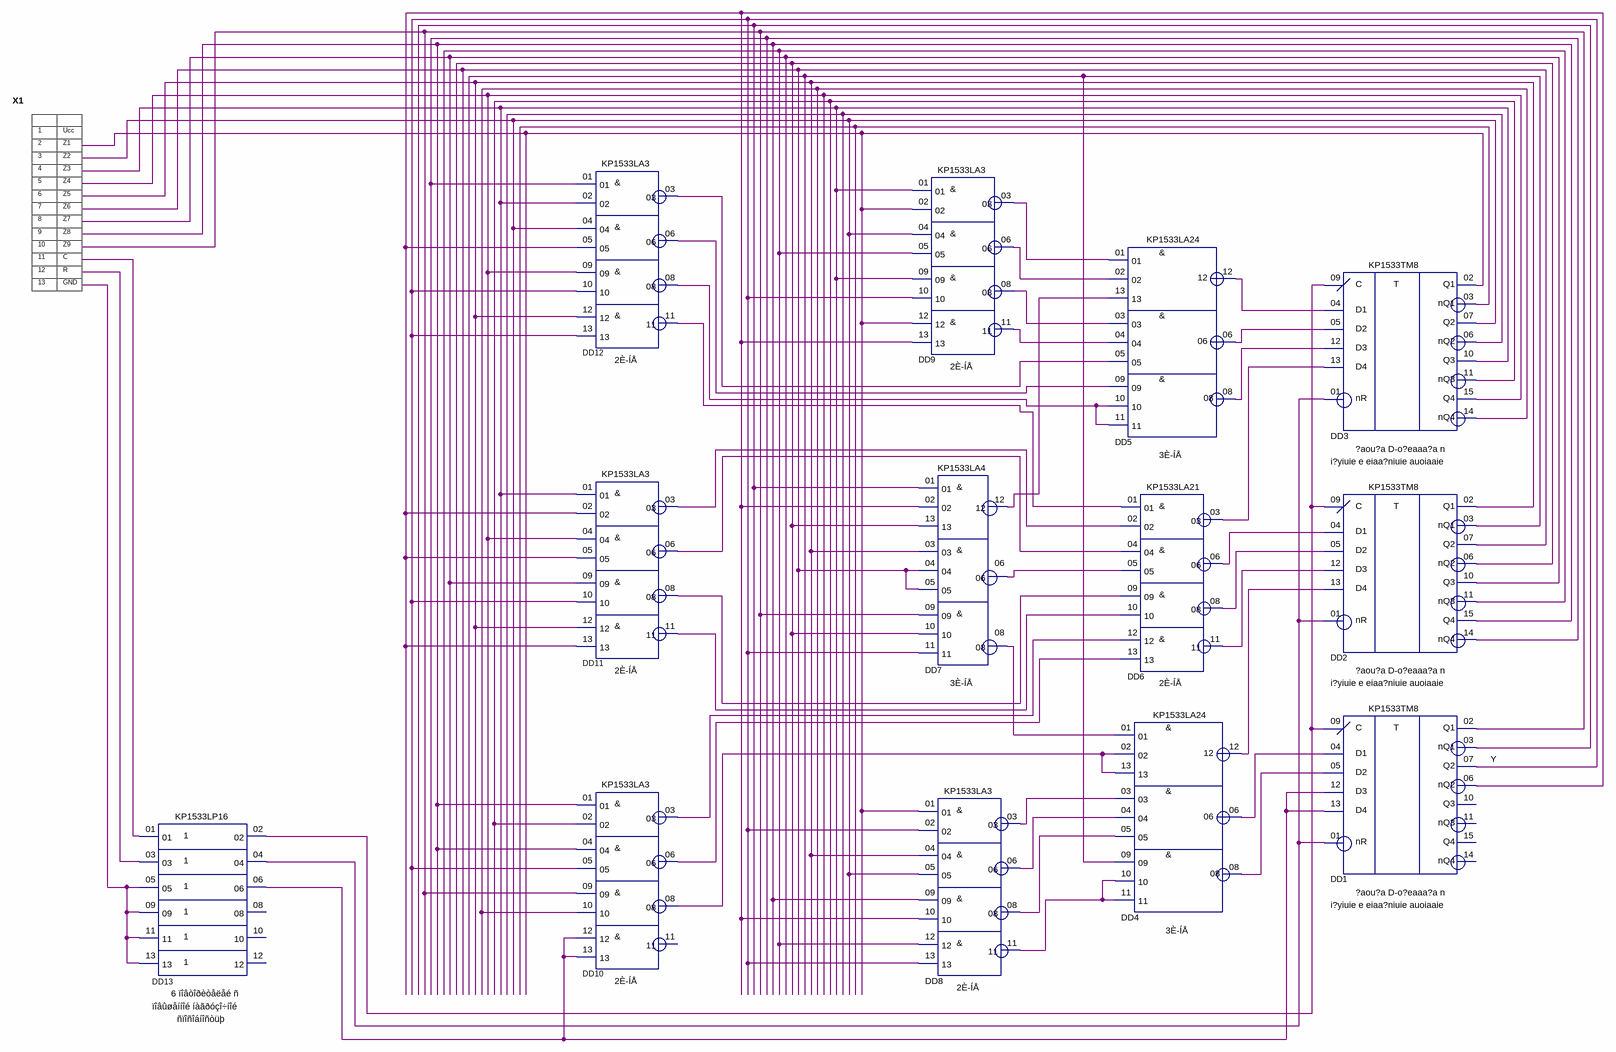
[diagram p0: schematic sheet]
// Quartus schematic _SR.bdf as structural Verilog: 13 symbols, 0 pins
module _SR (
);

  wire DD1_nq1, DD1_nq2, DD1_q1, DD2_nq1, DD2_nq2, DD2_nq3, DD2_nq4, DD2_q1, DD2_q2, DD2_q3, DD2_q4, DD3_nq1,
       DD3_nq2, DD3_nq3, DD3_nq4, DD3_q1, DD3_q2, DD3_q3, DD3_q4, DD4_06, DD4_08, DD4_12, DD5_06, DD5_08,
       DD5_12, DD6_03, DD6_06, DD6_08, DD6_11, DD7_06, DD7_08, DD7_12, DD8_03, DD8_06, DD8_08, DD8_11,
       DD9_03, DD9_06, DD9_08, DD9_11, DD10_03, DD10_06, DD10_08, DD11_03, DD11_06, DD11_08, DD11_11,
       DD12_03, DD12_06, DD12_08, DD12_11, DD13_02, DD13_04, DD13_06, undriven, undriven_2, undriven_3, Y;

  KP1533LP16 DD13 (
    .\01 (undriven_2), .\03 (undriven_3), .\05 (undriven), .\09 (undriven), .\11 (undriven), .\13 (undriven),
    .\02 (DD13_02), .\04 (DD13_04), .\06 (DD13_06));  // open: 08, 10, 12
  KP1533LA3 DD12 (
    .\01 (DD2_nq4), .\02 (DD3_q3), .\04 (DD3_q2), .\05 (DD1_nq2), .\09 (DD3_q4), .\10 (Y), .\12 (DD2_q1),
    .\13 (Y), .\03 (DD12_03), .\06 (DD12_06), .\08 (DD12_08), .\11 (DD12_11));
  KP1533LA3 DD11 (
    .\01 (DD3_q3), .\02 (DD1_nq2), .\04 (DD3_q4), .\05 (DD1_nq2), .\09 (DD2_q3), .\10 (Y), .\12 (DD2_q1),
    .\13 (DD1_nq2), .\03 (DD11_03), .\06 (DD11_06), .\08 (DD11_08), .\11 (DD11_11));
  KP1533LA3 DD10 (
    .\01 (DD2_q4), .\02 (DD3_nq3), .\04 (DD2_q4), .\05 (Y), .\09 (DD1_q1), .\10 (DD3_nq4), .\12 (DD13_06),
    .\13 (DD13_06), .\03 (DD10_03), .\06 (DD10_06), .\08 (DD10_08));  // open: 11
  KP1533LA3 DD9 (
    .\01 (DD3_q3), .\02 (DD3_q1), .\04 (DD3_q2), .\05 (DD2_nq3), .\09 (DD3_q3), .\10 (Y), .\12 (DD3_q1),
    .\13 (DD1_nq2), .\03 (DD9_03), .\06 (DD9_06), .\08 (DD9_08), .\11 (DD9_11));
  KP1533LA4 DD7 (
    .\01 (DD1_nq1), .\02 (DD1_nq2), .\13 (DD2_nq2), .\03 (DD2_q1), .\04 (DD2_q2), .\05 (DD2_q2),
    .\09 (DD1_q1), .\10 (DD2_nq2), .\11 (Y), .\12 (DD7_12), .\06 (DD7_06), .\08 (DD7_08));
  KP1533LA3 DD8 (
    .\01 (DD3_q1), .\02 (Y), .\04 (DD2_q1), .\05 (DD3_q2), .\09 (DD2_q4), .\10 (DD1_nq2), .\12 (DD2_nq3),
    .\13 (Y), .\03 (DD8_03), .\06 (DD8_06), .\08 (DD8_08), .\11 (DD8_11));
  KP1533LA24 DD5 (
    .\01 (DD9_03), .\02 (DD9_06), .\13 (DD7_12), .\03 (DD9_08), .\04 (DD9_11), .\05 (DD12_03),
    .\09 (DD12_06), .\10 (DD12_08), .\11 (DD12_08), .\12 (DD5_12), .\06 (DD5_06), .\08 (DD5_08));
  KP1533LA21 DD6 (
    .\01 (DD12_11), .\02 (DD11_03), .\04 (DD11_06), .\05 (DD7_06), .\09 (DD11_08), .\10 (DD11_11),
    .\12 (DD10_03), .\13 (DD10_06), .\03 (DD6_03), .\06 (DD6_06), .\08 (DD6_08), .\11 (DD6_11));
  KP1533LA24 DD4 (
    .\01 (DD7_08), .\02 (DD10_08), .\13 (DD10_08), .\03 (DD8_03), .\04 (DD8_06), .\05 (DD8_08),
    .\09 (DD2_nq1), .\10 (DD8_11), .\11 (DD8_11), .\12 (DD4_12), .\06 (DD4_06), .\08 (DD4_08));
  KP1533TM8 DD3 (
    .nR(DD13_04), .C(DD13_02), .D1(DD5_12), .D2(DD5_06), .D3(DD5_08), .D4(DD6_03), .Q1(DD3_q1),
    .nQ1(DD3_nq1), .Q2(DD3_q2), .nQ2(DD3_nq2), .Q3(DD3_q3), .nQ3(DD3_nq3), .Q4(DD3_q4), .nQ4(DD3_nq4));
  KP1533TM8 DD2 (
    .nR(DD13_04), .C(DD13_02), .D1(DD6_06), .D2(DD6_08), .D3(DD6_11), .D4(DD4_12), .Q1(DD2_q1),
    .nQ1(DD2_nq1), .Q2(DD2_q2), .nQ2(DD2_nq2), .Q3(DD2_q3), .nQ3(DD2_nq3), .Q4(DD2_q4), .nQ4(DD2_nq4));
  KP1533TM8 DD1 (
    .nR(DD13_04), .C(DD13_02), .D1(DD4_06), .D2(DD4_08), .D3(DD13_06), .D4(DD13_06), .Q1(DD1_q1),
    .nQ1(DD1_nq1), .Q2(Y), .nQ2(DD1_nq2));  // open: Q3, nQ3, Q4, nQ4

  // Notes on the sheet:
  //   X1
  //   1
  //   Ucc
  //   2
  //   Z1
  //   3
  //   Z2
  //   4
  //   Z3
  //   5
  //   Z4
  //   6
  //   Z5
  //   7
  //   Z6
  //   8
  //   Z7
  //   9
  //   Z8
  //   10
  //   Z9
  //   11
  //   C
  //   12
  //   R
  //   13
  //   GND
endmodule
